# EAGLE design new_board (EAGLE 9.5.0)
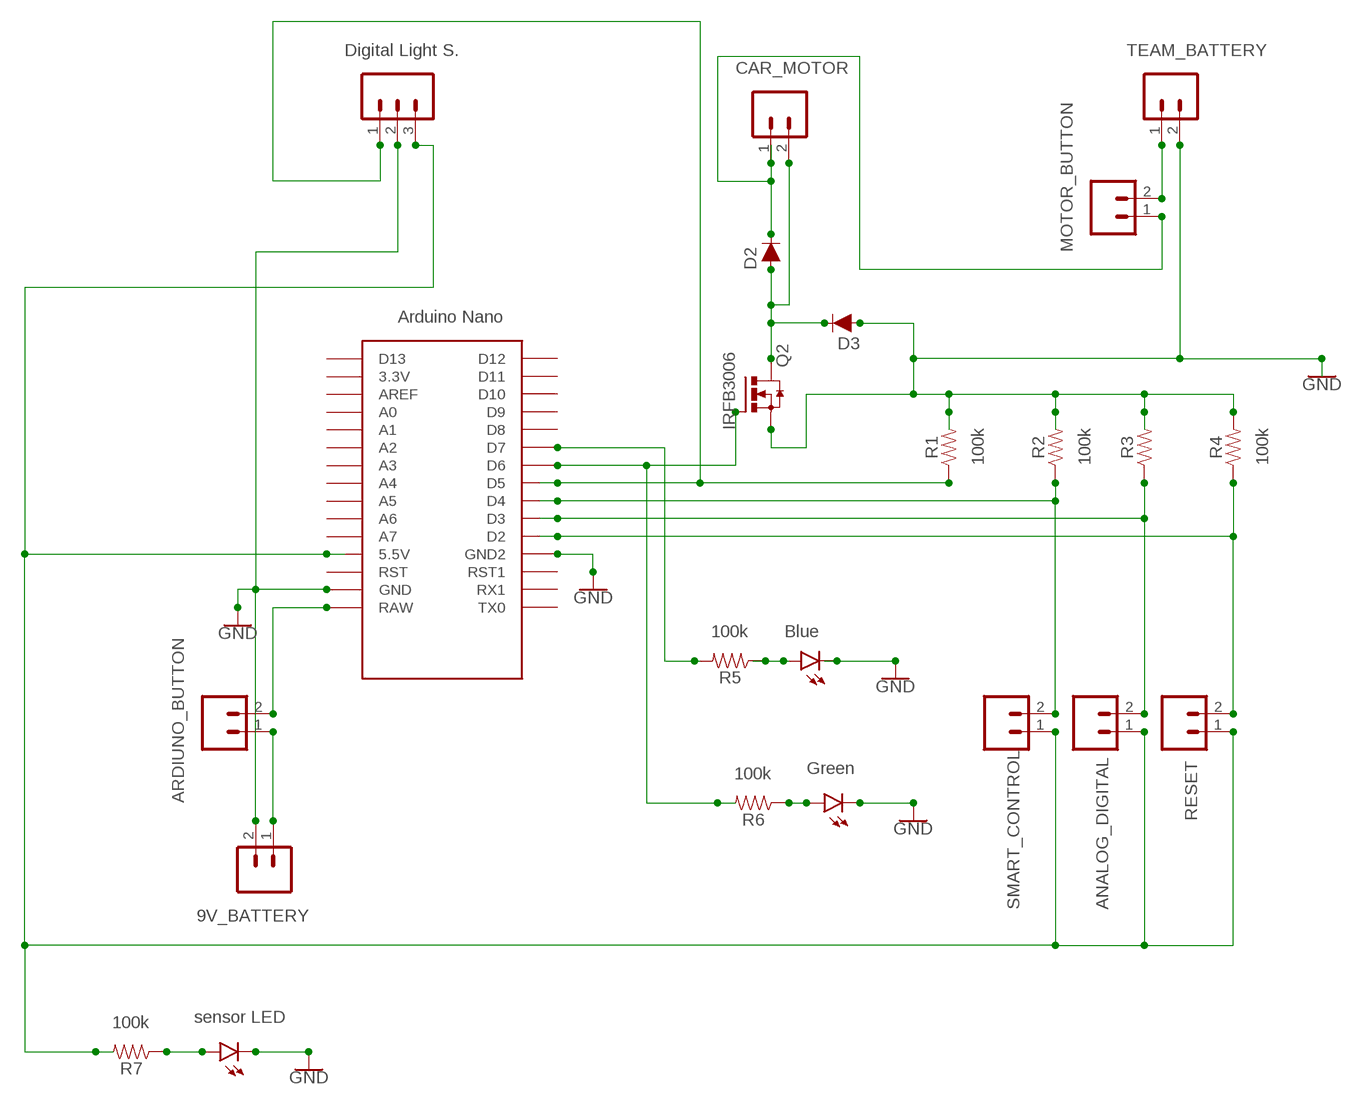
[diagram p0: schematic, sheet 1]

## Parts
D2  200mA/100V/1V  DIODE-1N4148  [DIODE-1N4148]
D3  200mA/100V/1V  DIODE-1N4148  [DIODE-1N4148]
D4  LED3MM  [LED_3MM]
D5  LED3MM  [LED_3MM]
D6  LED3MM  [LED_3MM]
J1  CONN_02  [1X02]
J2  CONN_02  [1X02]
J3  CONN_02  [1X02]
J4  455-1750-1-ND  CONN_03  [1X03]
Q2  IRF3704L-V  [TO262-V]
R1  1M  1MOHM-HORIZ-1/6W-5%  [AXIAL-0.3]
R2  1M  1MOHM-HORIZ-1/6W-5%  [AXIAL-0.3]
R3  1M  1MOHM-HORIZ-1/6W-5%  [AXIAL-0.3]
R4  1M  1MOHM-HORIZ-1/6W-5%  [AXIAL-0.3]
R5  1M  1MOHM-HORIZ-1/6W-5%  [AXIAL-0.3]
R6  1M  1MOHM-HORIZ-1/6W-5%  [AXIAL-0.3]
R7  1M  1MOHM-HORIZ-1/6W-5%  [AXIAL-0.3]
S1  CONN_02  [1X02]
S2  CONN_02  [1X02]
S3  CONN_02  [1X02]
S4  CONN_02  [1X02]
S5  CONN_02  [1X02]
U$1  NANO  [NANO]

## Nets
5V: J4.3 R7.P$2 S2.1 S4.1 S5.1 U$1.5V(5.5V)
GND: D4.K(C) D5.K(C) D6.K(C) J2.2 J4.2 U$1.GND U$1.GND1(GND2)
N$1: Q2.1(G) R6.P$2 U$1.D6
N$2: D2.A D3.C J1.2 Q2.2(D)
N$3: D3.A J3.2 Q2.3(S) R1.P$2 R2.P$2 R3.P$2 R4.P$2 ; supply symbol labelled GND
N$4: J4.1 R1.P$1 U$1.D5
N$5: R2.P$1 S2.2 U$1.D4
N$6: R3.P$1 S4.2 U$1.D3
N$7: R4.P$1 S5.2 U$1.D2
N$8: R5.P$2 U$1.D7
N$9: D4.A R5.P$1
N$10: D5.A R6.P$1
N$11: D2.C J1.1 S3.1
N$12: J2.1 S1.1
N$13: S1.2 U$1.RAW
N$15: J3.1 S3.2
N$17: D6.A R7.P$1
Unconnected: U$1.3.3V U$1.A0 U$1.A1 U$1.A2 U$1.A3 U$1.A4 U$1.A5 U$1.A6 U$1.A7 U$1.AREF U$1.D8 U$1.D9 U$1.D10 U$1.D11 U$1.D12 U$1.D13 U$1.ICSP1 U$1.ICSP2 U$1.ICSP3 U$1.ICSP4 U$1.ICSP5 U$1.ICSP6 U$1.RST U$1.RST1 U$1.RX1 U$1.TX0

## Library data of the parts
D2 D3 = SparkFun-DiscreteSemi:DIODE: Diode These are standard reverse protection diodes and small signal diodes. SparkFun Products: SparkFun SparkPunk Sound Kit <https://www.sparkfun.com/products/11177> SparkFun ESP8266 Thing <https://www.sparkfun.com/products/13231>; PROD_ID: DIO-08378
D4 = SparkFun-LED:LED: LED (Generic) Standard schematic elements and footprints for 5mm, 3mm, 1206, and 0603 sized LEDs. Generic LEDs with no color specified.; PROD_ID: Blue
D5 = SparkFun-LED:LED: LED (Generic) Standard schematic elements and footprints for 5mm, 3mm, 1206, and 0603 sized LEDs. Generic LEDs with no color specified.; PROD_ID: Green
D6 = SparkFun-LED:LED: LED (Generic) Standard schematic elements and footprints for 5mm, 3mm, 1206, and 0603 sized LEDs. Generic LEDs with no color specified.; PROD_ID: sensor LED
J1 J3 S1-S5 = SparkFun-Connectors:CONN_02: Multi connection point. Often used as Generic Header-pin footprint for 0.1 inch spaced/style header connections On any of the 0.1 inch spaced packages, you can populate with these: Break Away Headers - Straight <https://www.sparkfun.com/products/116> (PRT-00116) Break Away Male Headers - Right Angle <https://www.sparkfun.com/products/553> (PRT-00553) Female Headers <https://www.sparkfun.com/products/115> (PRT-00115) Break Away Headers - Machine Pin <https://www.sparkfun.com/products/117> (PRT-00117) Break Away Female Headers - Swiss Machine Pin <https://www.sparkfun.com/products/743> (PRT-00743) For SCREWTERMINALS and SPRING TERMINALS visit here: Screw Terimnals on SparkFun.com <https://www.sparkfun.com/search/results?term=Screw+Terminals> (5mm/3.5mm/2.54mm spacing) This device is also useful as a general connection point to wire up your design to another part of your project. Our various solder wires solder well into these plated through hole pads. Hook-Up Wire - Assortment (Stranded, 22 AWG) <https://www.sparkfun.com/products/11375> (PRT-11375) Hook-Up Wire - Assortment (Solid Core, 22 AWG) <https://www.sparkfun.com/products/11367> (PRT-11367) View the entire wire category on our website here <https://www.sparkfun.com/categories/141> Special notes: Molex polarized connector foot print use with: PRT-08233 with associated crimp pins and housings. 2.54_SCREWTERM for use with PRT-10571. 3.5mm Screw Terminal footprints for PRT-08084 5mm Screw Terminal footprints for use with PRT-08432
J2 = SparkFun-Connectors:CONN_02: Multi connection point. Often used as Generic Header-pin footprint for 0.1 inch spaced/style header connections On any of the 0.1 inch spaced packages, you can populate with these: Break Away Headers - Straight <https://www.sparkfun.com/products/116> (PRT-00116) Break Away Male Headers - Right Angle <https://www.sparkfun.com/products/553> (PRT-00553) Female Headers <https://www.sparkfun.com/products/115> (PRT-00115) Break Away Headers - Machine Pin <https://www.sparkfun.com/products/117> (PRT-00117) Break Away Female Headers - Swiss Machine Pin <https://www.sparkfun.com/products/743> (PRT-00743) For SCREWTERMINALS and SPRING TERMINALS visit here: Screw Terimnals on SparkFun.com <https://www.sparkfun.com/search/results?term=Screw+Terminals> (5mm/3.5mm/2.54mm spacing) This device is also useful as a general connection point to wire up your design to another part of your project. Our various solder wires solder well into these plated through hole pads. Hook-Up Wire - Assortment (Stranded, 22 AWG) <https://www.sparkfun.com/products/11375> (PRT-11375) Hook-Up Wire - Assortment (Solid Core, 22 AWG) <https://www.sparkfun.com/products/11367> (PRT-11367) View the entire wire category on our website here <https://www.sparkfun.com/categories/141> Special notes: Molex polarized connector foot print use with: PRT-08233 with associated crimp pins and housings. 2.54_SCREWTERM for use with PRT-10571. 3.5mm Screw Terminal footprints for PRT-08084 5mm Screw Terminal footprints for use with PRT-08432; 9V_BATTERY: 9V
J4 = SparkFun-Connectors:CONN_03: Multi connection point. Often used as Generic Header-pin footprint for 0.1 inch spaced/style header connections On any of the 0.1 inch spaced packages, you can populate with these: Break Away Headers - Straight <https://www.sparkfun.com/products/116> (PRT-00116) Break Away Male Headers - Right Angle <https://www.sparkfun.com/products/553> (PRT-00553) Female Headers <https://www.sparkfun.com/products/115> (PRT-00115) Break Away Headers - Machine Pin <https://www.sparkfun.com/products/117> (PRT-00117) Break Away Female Headers - Swiss Machine Pin <https://www.sparkfun.com/products/743> (PRT-00743) Stackable Header - 3 Pin (Female, 0.1") <https://www.sparkfun.com/products/13875> (PRT-13875) For SCREWTERMINALS and SPRING TERMINALS visit here: Screw Terimnals on SparkFun.com <https://www.sparkfun.com/search/results?term=Screw+Terminals> (5mm/3.5mm/2.54mm spacing) This device is also useful as a general connection point to wire up your design to another part of your project. Our various solder wires solder well into these plated through hole pads. Hook-Up Wire - Assortment (Stranded, 22 AWG) <https://www.sparkfun.com/products/11375> (PRT-11375) Hook-Up Wire - Assortment (Solid Core, 22 AWG) <https://www.sparkfun.com/products/11367> (PRT-11367) View the entire wire category on our website here <https://www.sparkfun.com/categories/141> Special notes: Molex polarized connector foot print use with SKU : PRT-08232 with associated crimp pins and housings.; PROD_ID: Digital Light S.
Q2 = transistor-power:IRF3704: SMPS MOSFET HEXFET® Power MOSFET Source: http://www.irf.com/product-info/datasheets/data/irf3704.pdf
R1 R2 R4-R7 = SparkFun-Resistors:1MOHM: 1MΩ resistor A resistor is a passive two-terminal electrical component that implements electrical resistance as a circuit element. Resistors act to reduce current flow, and, at the same time, act to lower voltage levels within circuits. - Wikipedia; PROD_ID: 100k
R3 = SparkFun-Resistors:1MOHM: 1MΩ resistor A resistor is a passive two-terminal electrical component that implements electrical resistance as a circuit element. Resistors act to reduce current flow, and, at the same time, act to lower voltage levels within circuits. - Wikipedia; PROD_ID: RES-09559
U$1 = Arduino-clone:NANO: Arduino Nano

## Board
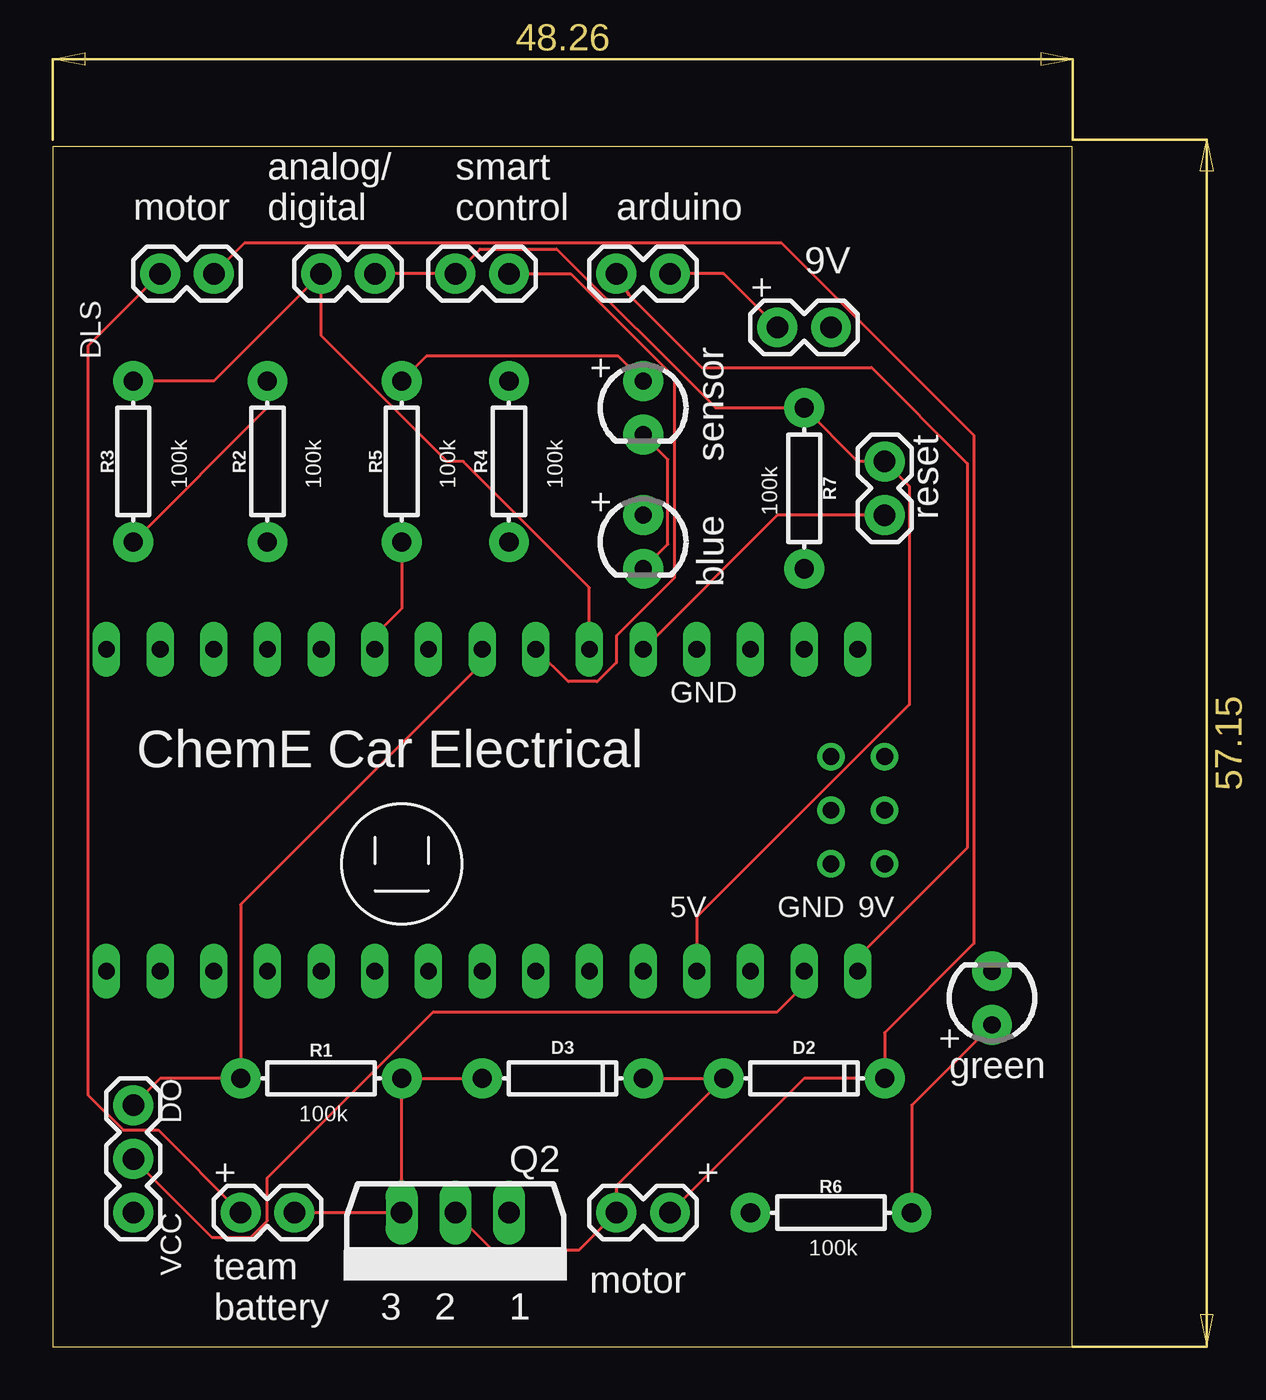
[diagram p1: board, top side]
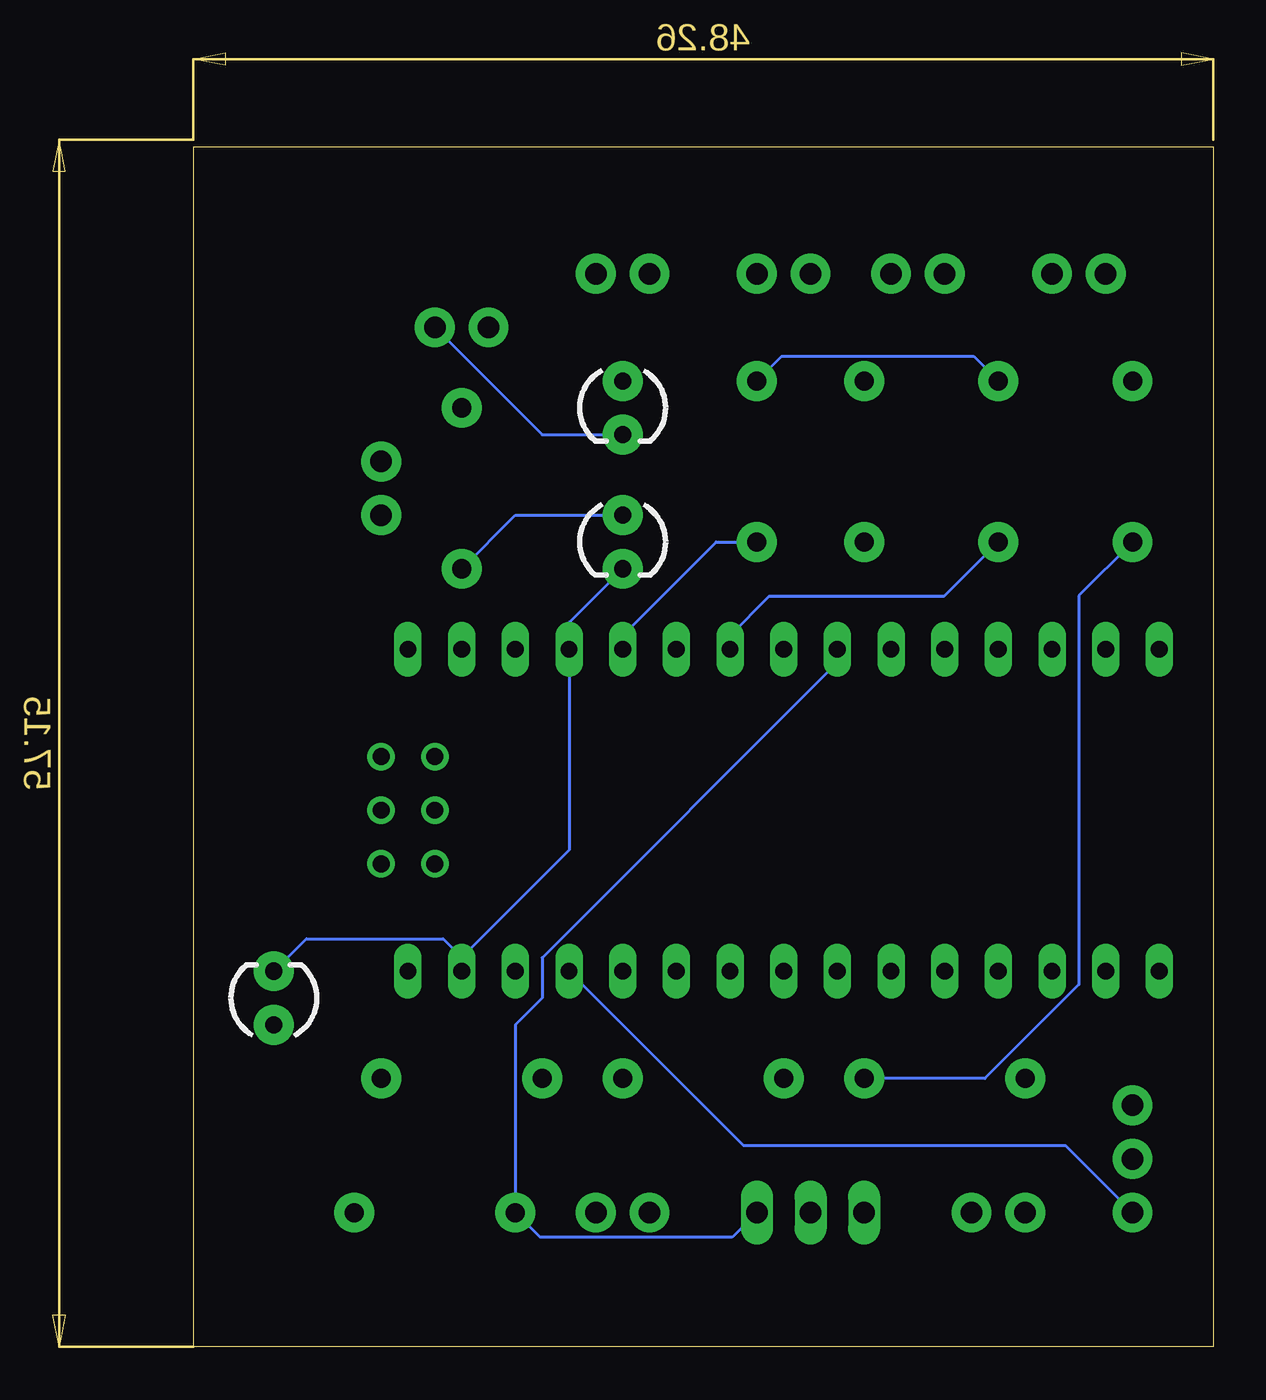
[diagram p2: board, bottom side, seen from below]

Size 48.24 x 56.82 mm. Coordinates in mm from the lower left corner, seen from the top.
Outline: 0,0 48.24,0 48.24,56.82 0,56.82 0,0
Copper layers (1*16): Top 0.035mm / dielectric 0.15mm / Bottom 0.035mm
Design rules "default": minimum track width 6mil, minimum drill 0.35mm, track to track 6mil, track to pad 6mil, pad to pad 6mil, via to via 6mil, smd to smd 6mil, copper to edge 40mil, drill to drill 6mil, minimum pad ring 10mil, minimum via ring 8mil, stop-mask expansion 4mil, vias tented up to drill 0mil, thermal gap 10mil

### Footprints (pad centres in the part's own frame; a part is rotated, then mirrored left to right if it is on the bottom)
DIODE-1N4148 = drill 0.9 pad 1.88: A -3.81,0; C 3.81,0
LED_3MM = drill 0.813 pad 1.88: A -1.27,0; K 1.27,0
1X02 = drill 1.016 pad 1.88: 1 0,0; 2 2.54,0
1X03 = drill 1.016 pad 1.88: 1 0,0; 2 2.54,0; 3 5.08,0
TO262-V = drill 1.016 long: 1 -2.54,0; 2 0,0; 3 2.54,0
AXIAL-0.3 = drill 0.9 pad 1.88: P$1 -3.81,0; P$2 3.81,0
NANO = drill 0.8 long: 3.3V -10.16,24.13; 5V -10.16,-1.27; A0 -10.16,19.05; A1 -10.16,16.51; A2 -10.16,13.97; A3 -10.16,11.43; A4 -10.16,8.89; A5 -10.16,6.35; A6 -10.16,3.81; A7 -10.16,1.27; AREF -10.16,21.59; D2 5.08,1.27; D3 5.08,3.81; D4 5.08,6.35; D5 5.08,8.89; D6 5.08,11.43; D7 5.08,13.97; D8 5.08,16.51; D9 5.08,19.05; D10 5.08,21.59; D11 5.08,24.13; D12 5.08,26.67; D13 -10.16,26.67; GND -10.16,-6.35; GND1 5.08,-1.27; RAW -10.16,-8.89; RST -10.16,-3.81; RST1 5.08,-3.81; RX1 5.08,-6.35; TX0 5.08,-8.89 | drill 0.8: ICSP1 -5.08,-10.16; ICSP2 -5.08,-7.62; ICSP3 -2.54,-10.16; ICSP4 -2.54,-7.62; ICSP5 0,-10.16; ICSP6 0,-7.62

### Placement (x,y rotation side)
D2  35.56,12.7 0 top
D3  24.13,12.7 0 top
D4  27.94,44.45 270 top
D5  44.45,16.51 90 top
D6  27.94,38.1 270 top
J1  29.21,6.35 180 top
J2  34.29,48.26 0 top
J3  8.89,6.35 0 top
J4  3.81,11.43 270 top
Q2  19.05,6.35 180 top
R1  12.7,12.7 0 top
R2  10.16,41.91 90 top
R3  3.81,41.91 270 top
R4  21.59,41.91 90 top
R5  16.51,41.91 270 top
R6  36.83,6.35 180 top
R7  35.56,40.64 90 top
S1  29.21,50.8 180 top
S2  19.05,50.8 0 top
S3  7.62,50.8 180 top
S4  15.24,50.8 180 top
S5  39.37,41.91 270 top
U$1  29.21,27.94 90 top

### Tracks (layer width: path | path; a pad name or v marks a point on that pad's centre or on a via)
5V
  Top 0.152: S4.1 S2.1 20.22,51.97 23.85,51.97 31.37,44.45 R7.P$2 38.1,41.91 S5.1 40.54,40.74 40.54,30.4 30.48,20.34 U$1.5V
  Bottom 0.152: J4.3 6.99,9.53 22.23,9.53 U$1.5V
GND
  Top 0.152: D6.K 29.11,38 29.11,42.01 D4.K | J4.2 7.52,5.18 9.37,5.18 10.16,5.97 10.16,8 18.01,15.86 34.29,15.86 35.56,17.13 U$1.GND
  Bottom 0.152: 35.56,18.43 30.48,23.51 U$1.GND1 30.48,34.29 D6.K | J2.2 31.75,43.18 D4.K | 35.56,18.43 U$1.GND | D5.K 42.91,19.32 36.44,19.32 35.56,18.43
N$1
  Bottom 0.152: U$1.D6 17.78,32.37 17.8,32.37 31.75,18.41 31.75,16.51 33.02,15.24 R6.P$2 31.85,5.18 22.76,5.18 Q2.1
N$2
  Top 0.152: D3.C D2.A 26.67,7.62 J1.2 24.92,4.6 20.8,4.6 Q2.2
N$3
  Top 0.152: R2.P$2 10.16,44.45 R3.P$2 | D3.A R1.P$2 Q2.3 J3.2
  Bottom 0.152: R3.P$2 6.35,35.56 6.35,17.15 10.8,12.7 R1.P$2 | R4.P$2 20.42,46.89 11.33,46.89 R2.P$2
N$4
  Top 0.152: J4.1 5.08,12.7 R1.P$1 8.89,20.94 20.32,32.37 U$1.D5
N$5
  Top 0.152: U$1.D4 24.4,31.48 25.77,31.48 26.67,32.39 26.67,33.65 29.41,36.4 29.41,45.9 24.51,50.8 S2.2
  Bottom 0.152: U$1.D4 22.86,33.67 21,35.53 12.73,35.53 R2.P$1
N$6
  Top 0.152: U$1.D3 25.4,35.94 19.43,41.91 18.67,41.91 12.7,47.88 S4.2 7.62,45.72 R3.P$1
N$7
  Top 0.152: S5.2 34.29,39.37 U$1.D2
  Bottom 0.152: U$1.D2 27.94,33.67 23.51,38.1 R4.P$1
N$8
  Top 0.152: R5.P$2 16.51,34.94 15.24,33.67 U$1.D7
N$9
  Top 0.152: D4.A 26.77,46.89 17.68,46.89 R5.P$1
N$10
  Top 0.152: D5.A 40.64,11.43 R6.P$1
N$11
  Top 0.152: J1.1 35.56,12.7 D2.C 39.37,14.86 43.59,19.08 43.59,43.15 34.47,52.27 9.09,52.27 S3.1
N$12
  Top 0.152: J2.1 31.75,50.8 S1.1
N$13
  Top 0.152: U$1.RAW 38.1,18.43 43.29,23.62 43.29,41.82 38.75,46.35 30.71,46.35 27.26,49.81 S1.2
N$15
  Top 0.152: J3.1 4.98,10.26 3.33,10.26 1.66,11.93 1.66,47.38 S3.2
N$17
  Bottom 0.152: R7.P$1 33.02,39.37 D6.A

### Text on the board
tPlace: motor | analog/ / digital | smart / control | arduino | 9V | DLS | + | + | reset | sensor | 100k | 100k | 100k | 100k | + | blue | 100k | GND | ChemE Car Electrical | 5V | GND | 9V | + | green | DO | 100k | + | + | VCC | 100k | 3 | 2 | motor | team / battery | 1